# Altium schematic sheet 200512B_Schematic.SchDoc: 300W AMPLIFIER
size 520 x 788 mm; SheetNumber: 1; SheetTotal: 1
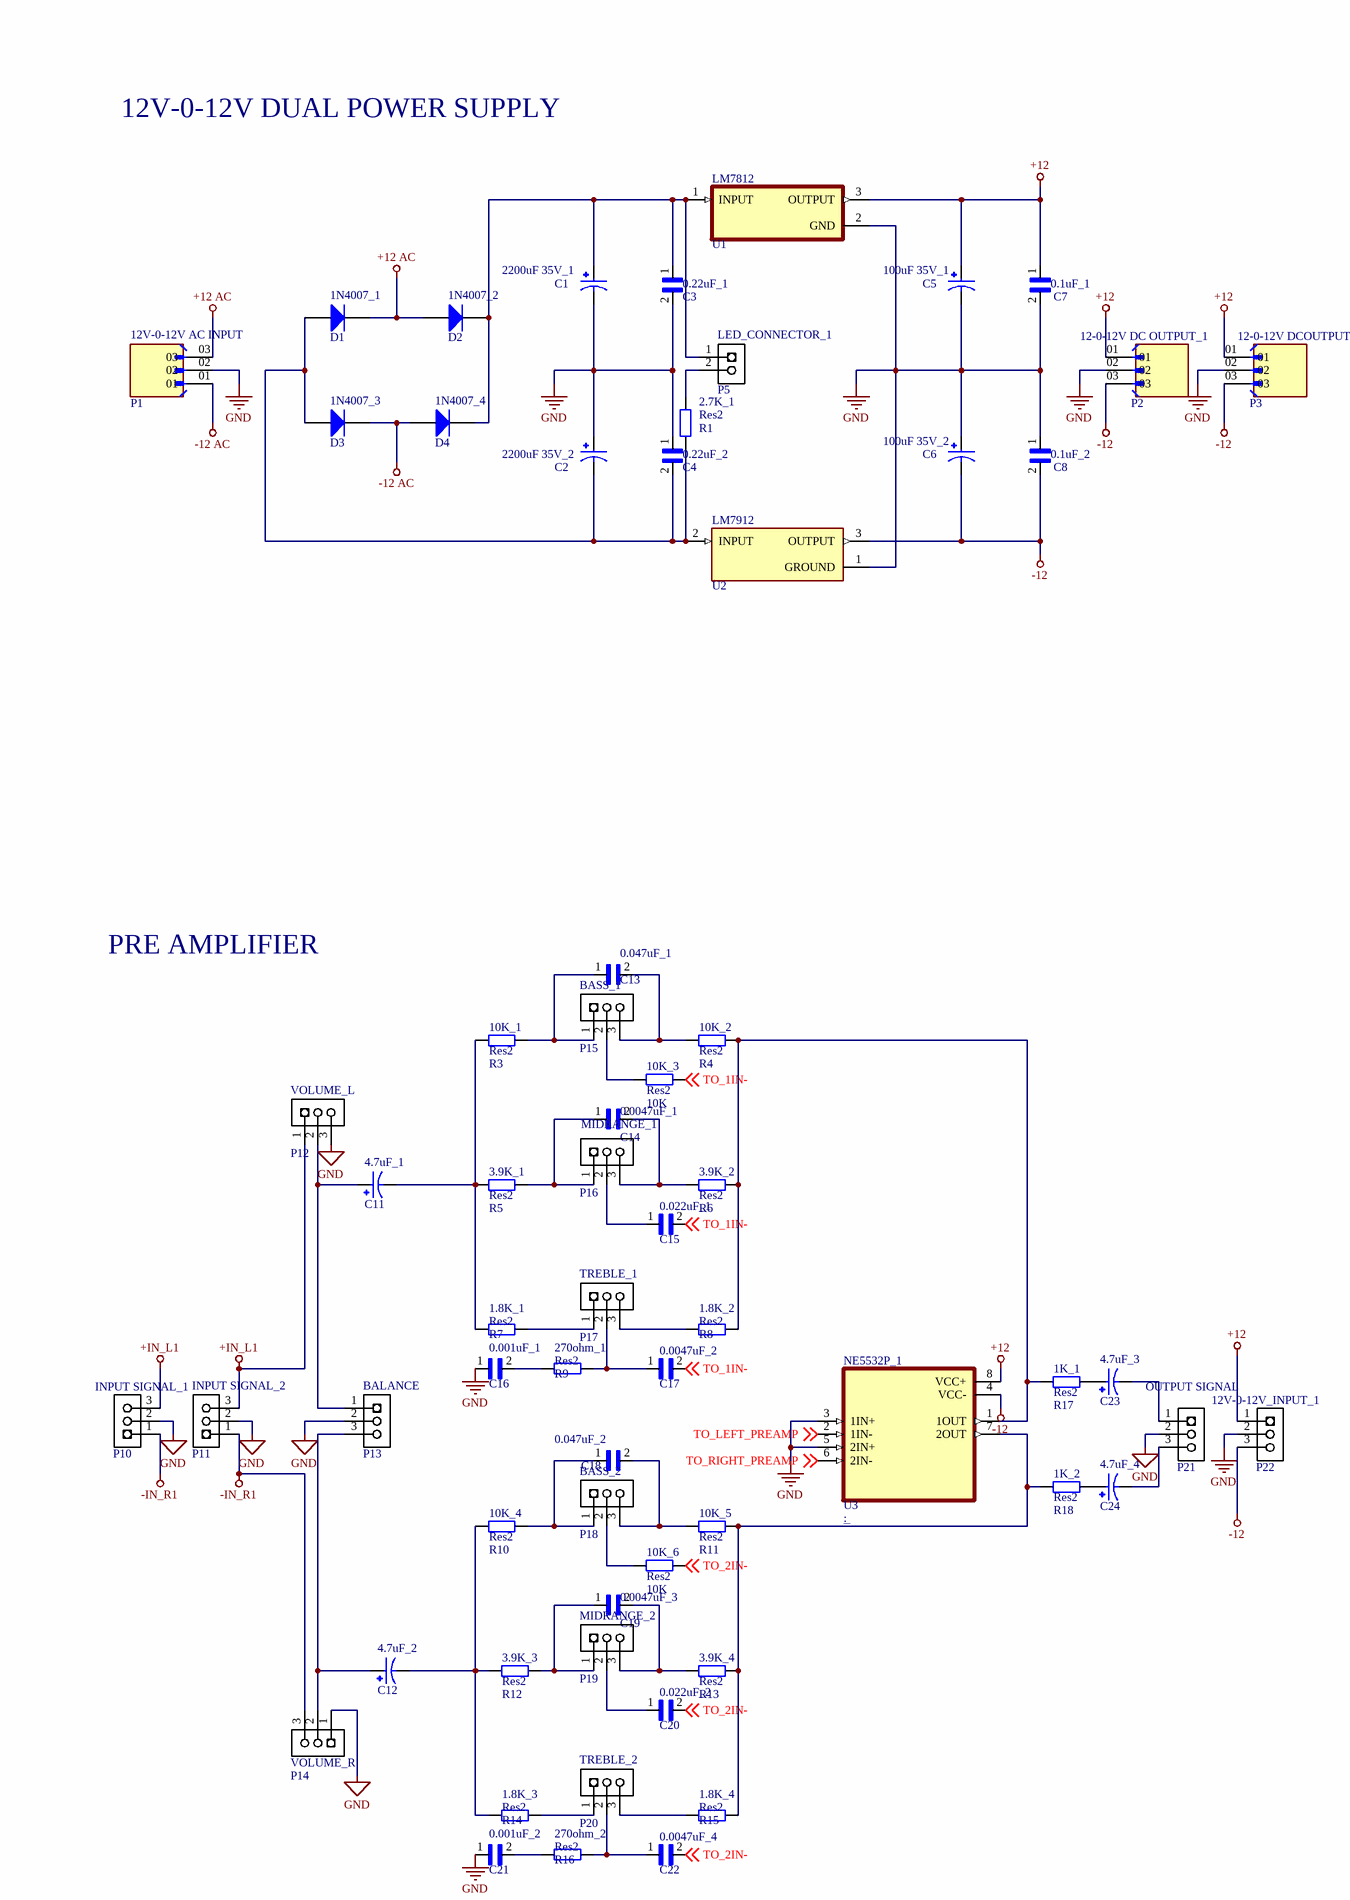
[diagram p0: 200512B_Schematic.SchDoc, top left]
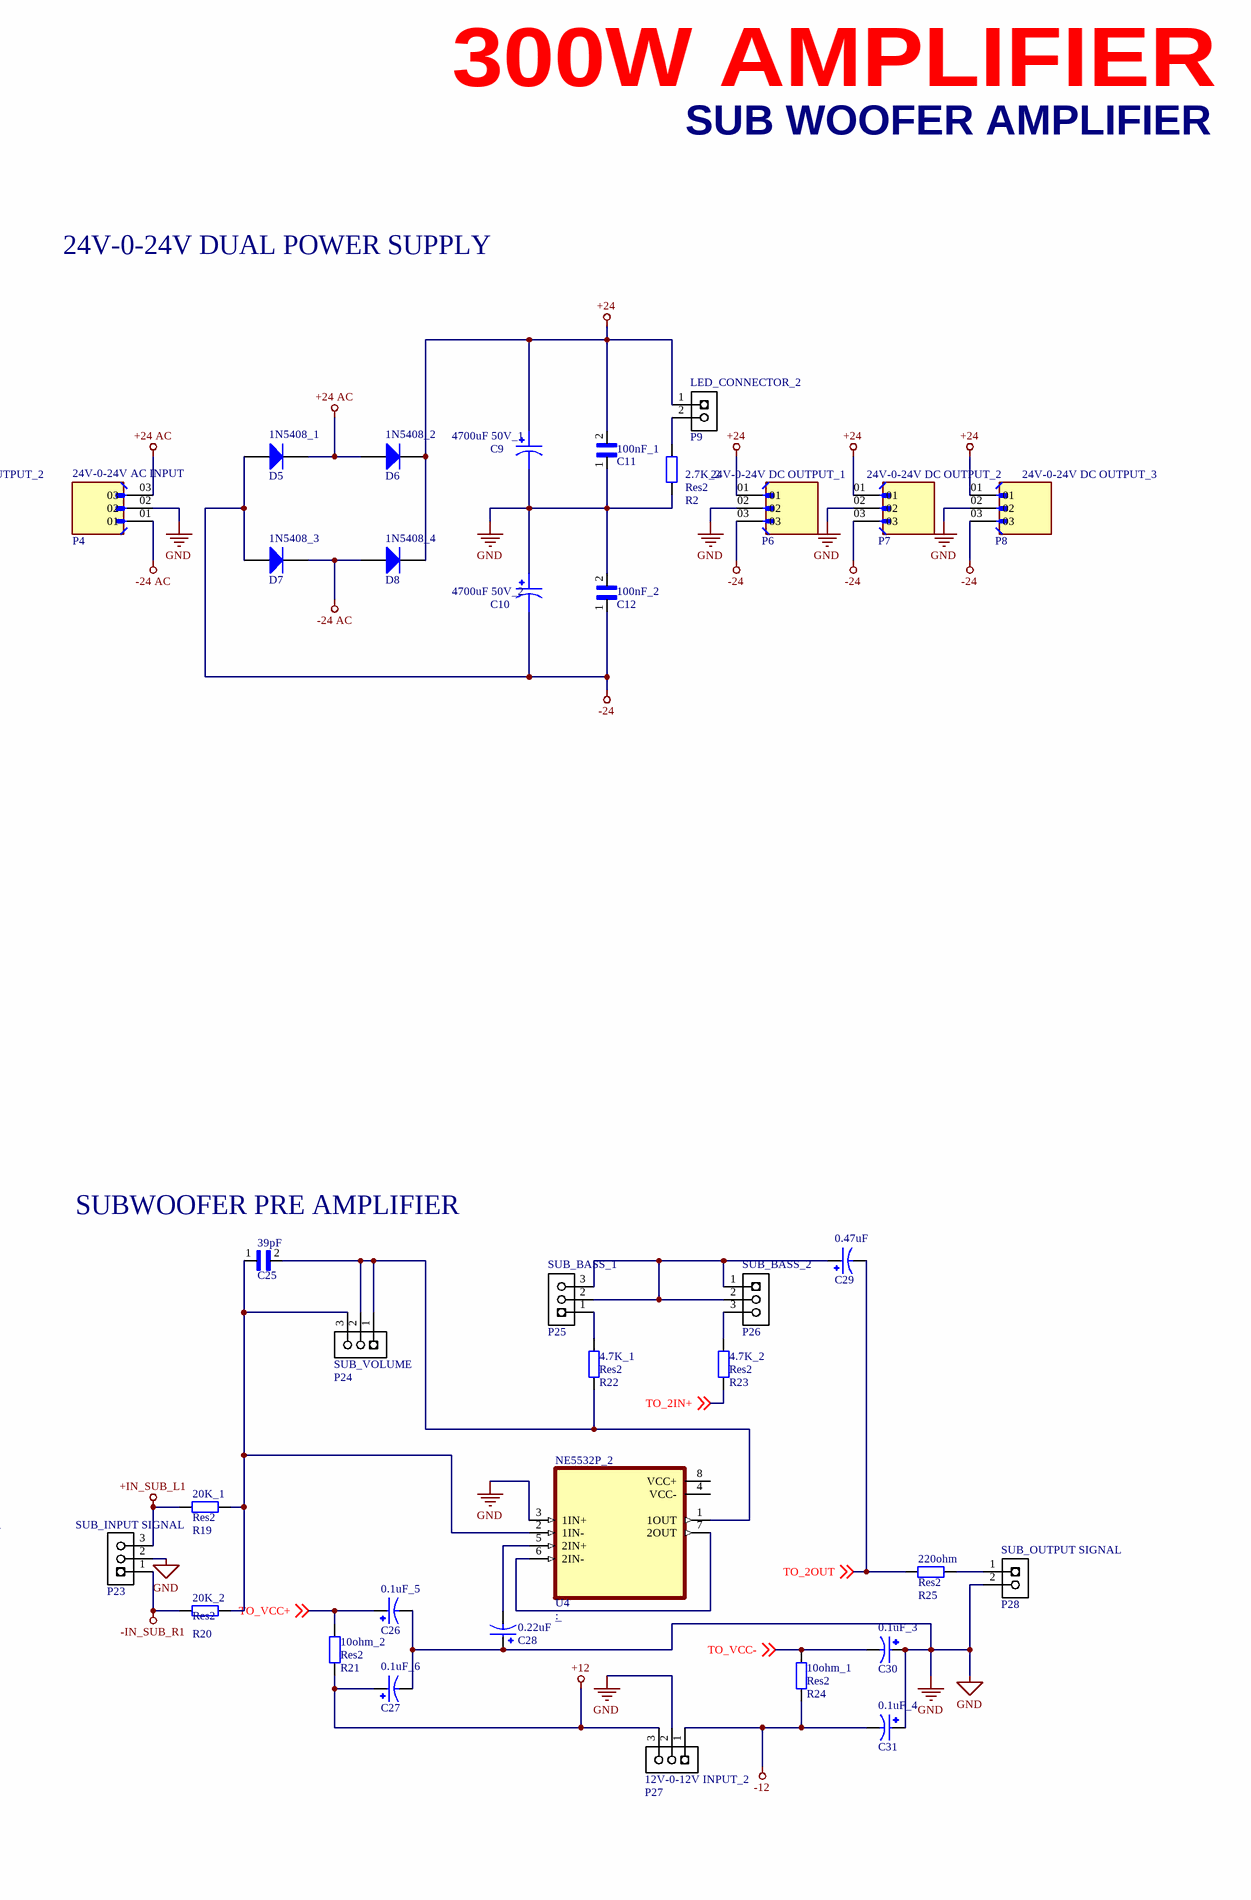
[diagram p1: 200512B_Schematic.SchDoc, top right]
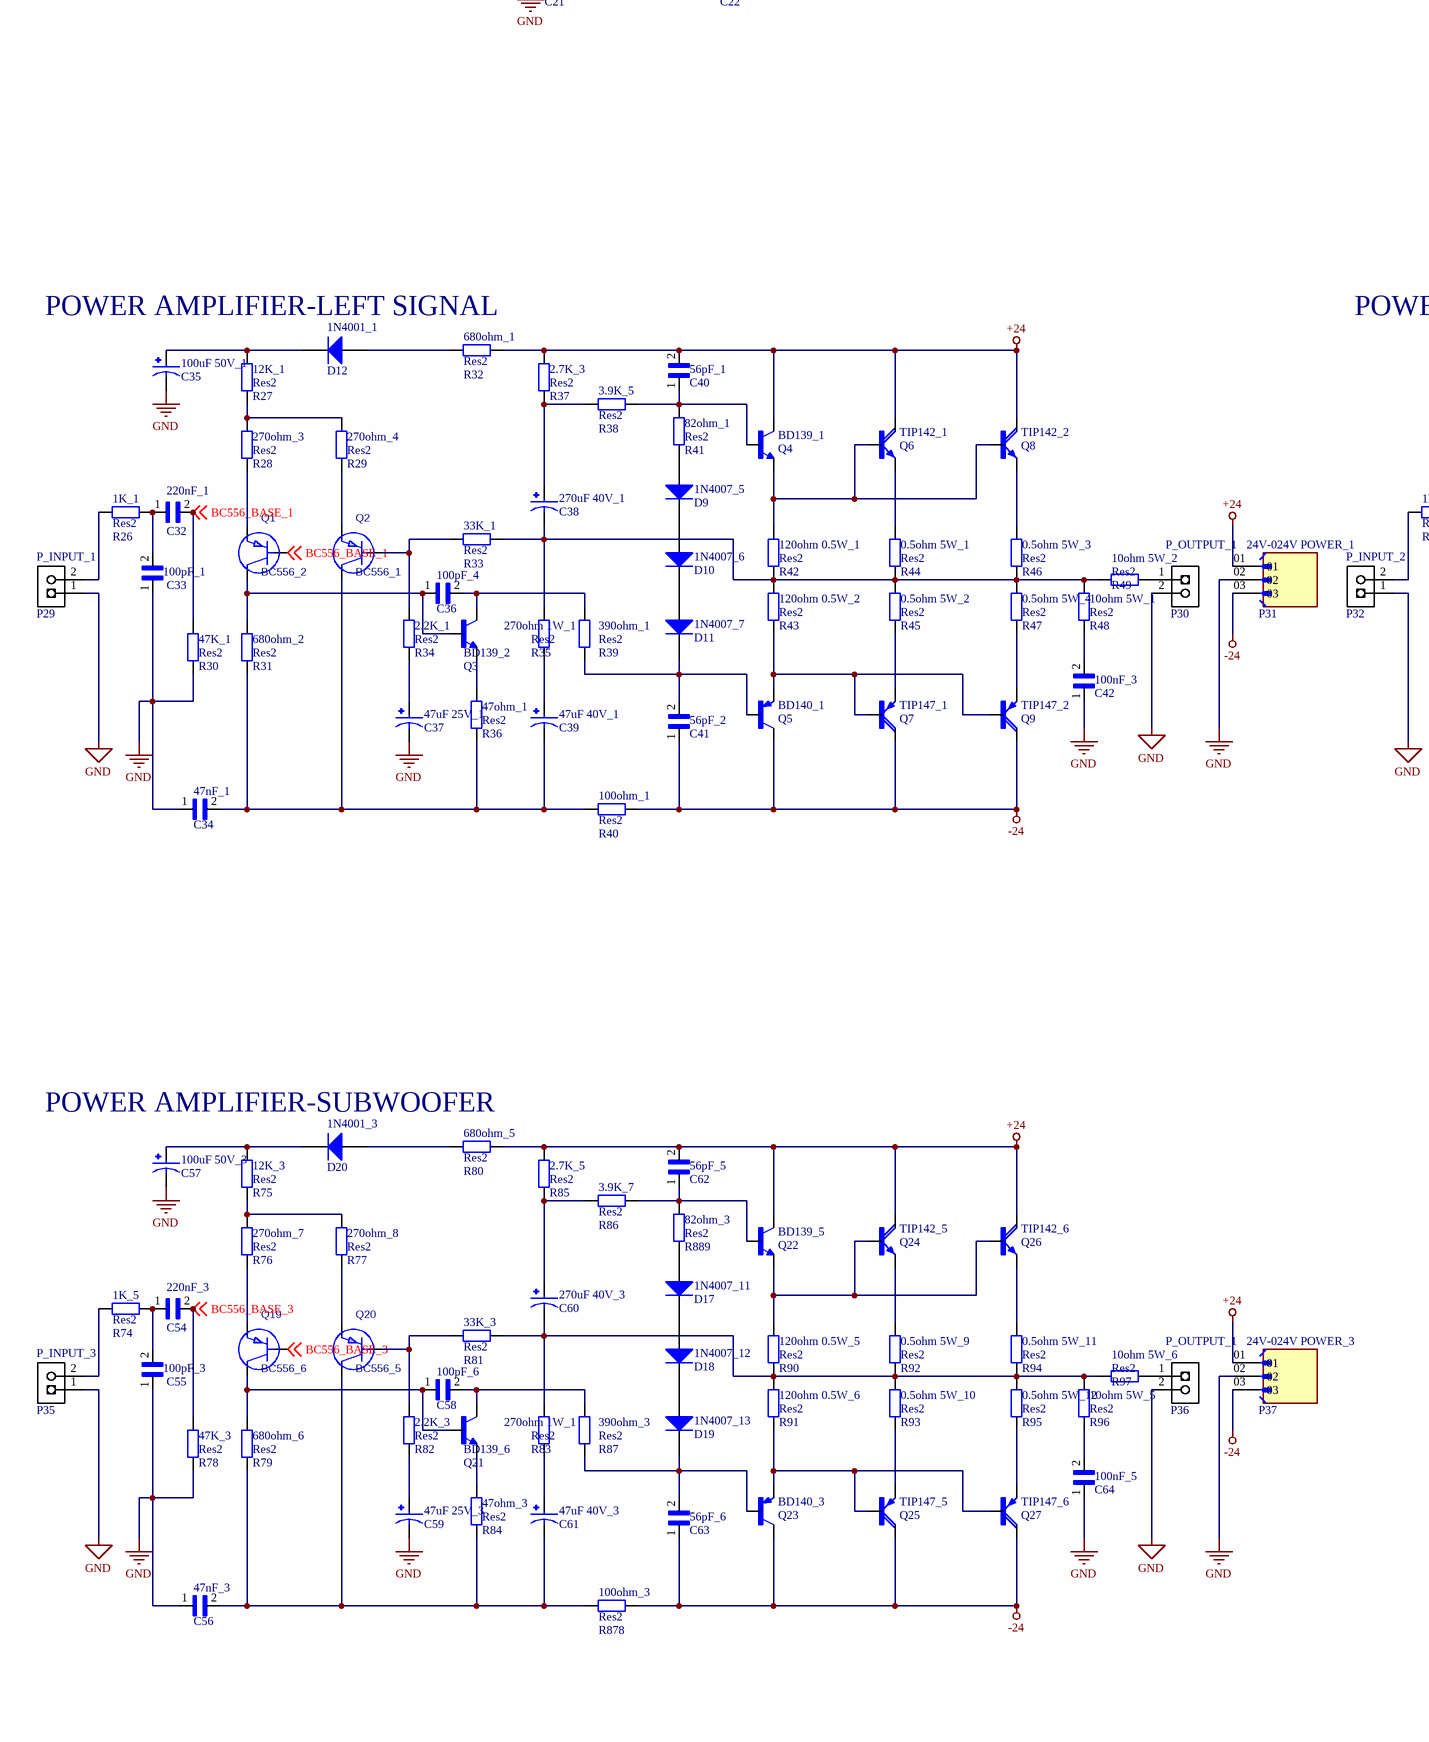
[diagram p2: 200512B_Schematic.SchDoc, bottom left]
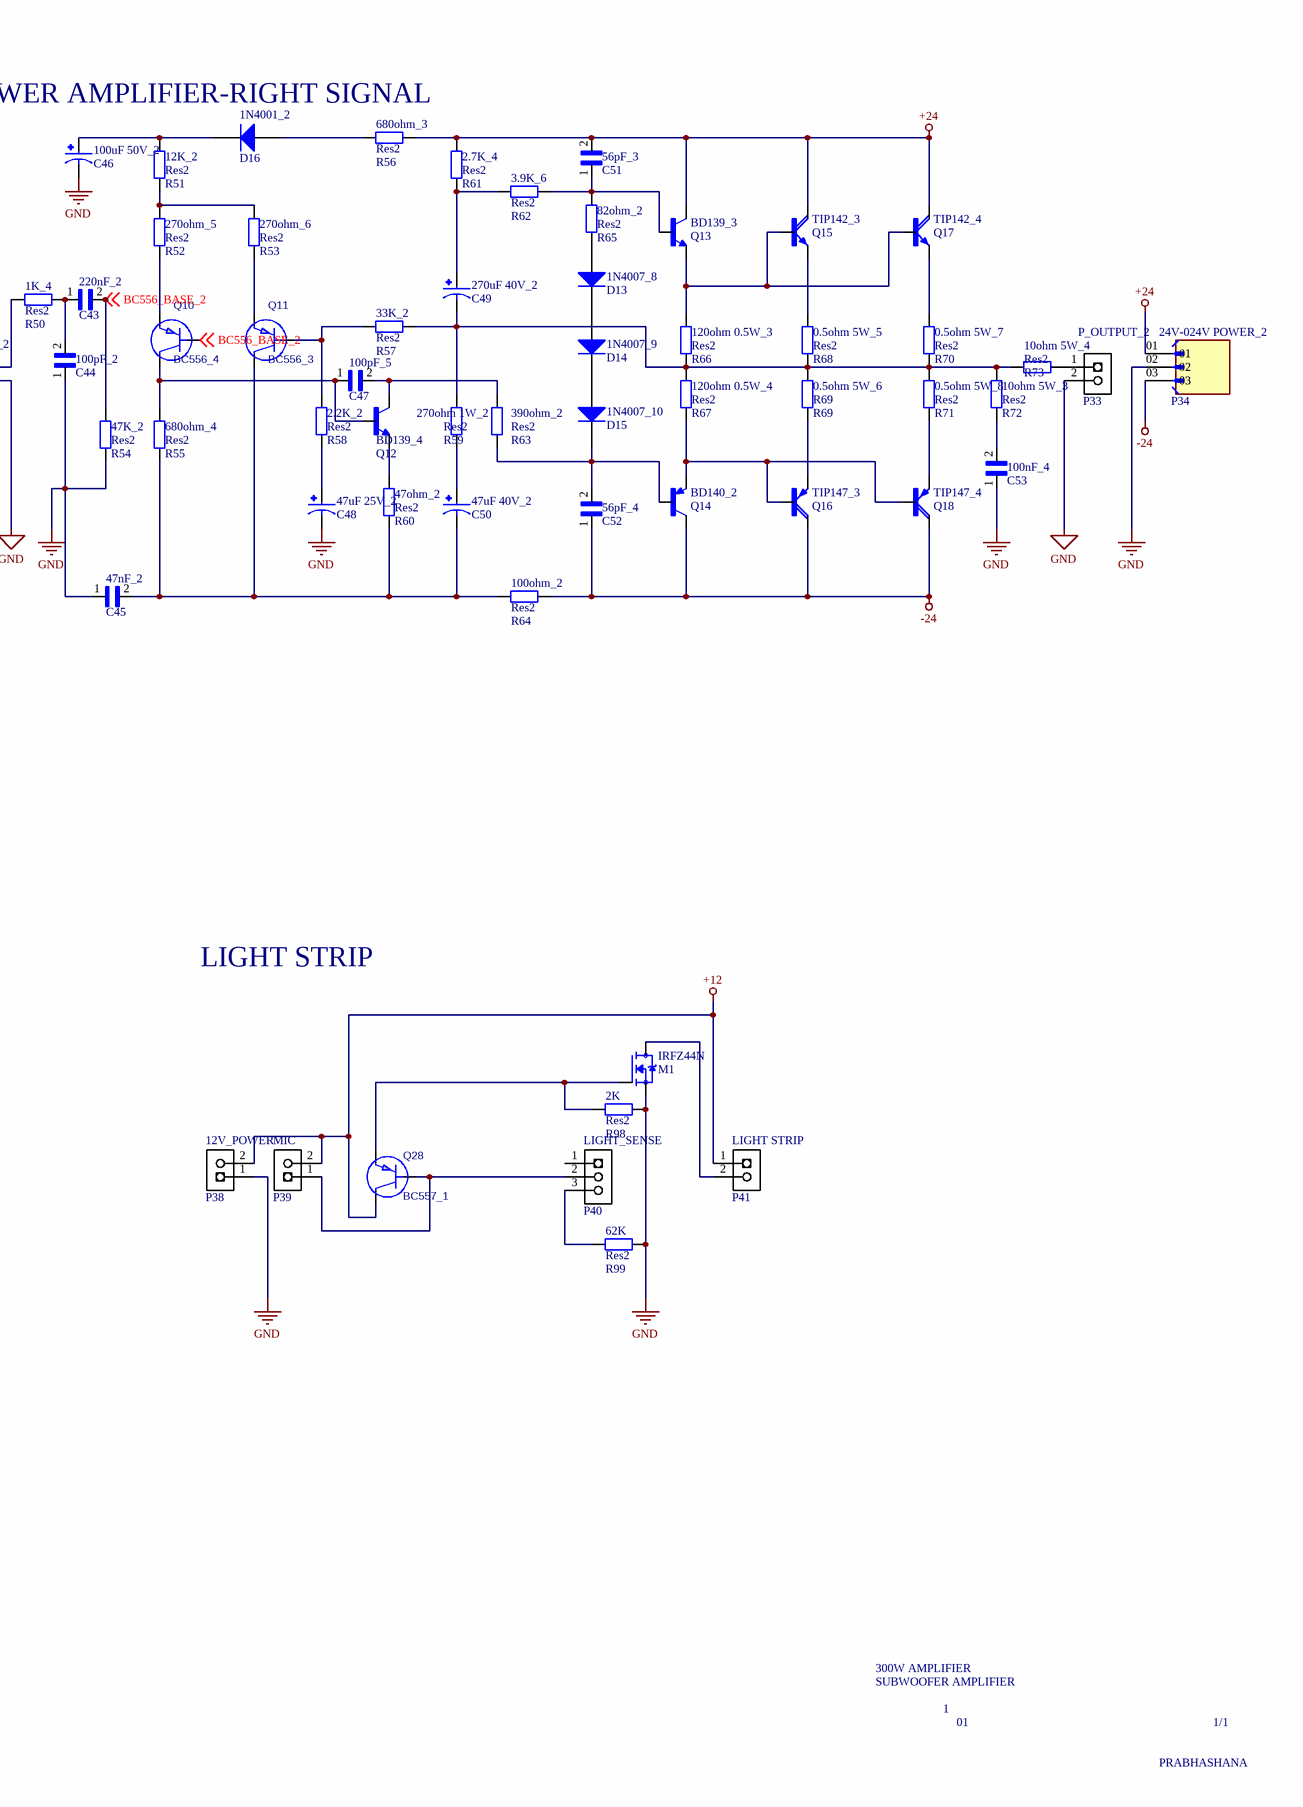
[diagram p3: 200512B_Schematic.SchDoc, bottom right]

## Parts
(Parts that share a designator on the sheet are numbered #1, #2 ... from top to bottom, then left to right.)
0.001uF_1  C16  [CAP_RDE5C1H273J2M1H03A]
0.1uF_1  C7  [CAP_RDE5C1H273J2M1H03A]
0.001uF_2  C21  [CAP_RDE5C1H273J2M1H03A]
0.1uF_2  C8  [CAP_RDE5C1H273J2M1H03A]
0.1uF_3  C30  [CAPPRD350W60D800H1150]
0.1uF_4  C31  [CAPPRD350W60D800H1150]
0.1uF_5  C26  [CAPPRD350W60D800H1150]
0.1uF_6  C27  [CAPPRD350W60D800H1150]
0.5ohm_5W_1  Res2  value R44  [AXIAL-0.4]
0.5ohm_5W_2  Res2  value R45  [AXIAL-0.4]
0.5ohm_5W_3  Res2  value R46  [AXIAL-0.4]
0.5ohm_5W_4  Res2  value R47  [AXIAL-0.4]
0.5ohm_5W_5  Res2  value R68  [AXIAL-0.4]
0.5ohm_5W_6  R69  [AXIAL-0.4]
0.5ohm_5W_7  Res2  value R70  [AXIAL-0.4]
0.5ohm_5W_8  Res2  value R71  [AXIAL-0.4]
0.5ohm_5W_9  Res2  value R92  [AXIAL-0.4]
0.5ohm_5W_10  Res2  value R93  [AXIAL-0.4]
0.5ohm_5W_11  Res2  value R94  [AXIAL-0.4]
0.5ohm_5W_12  Res2  value R95  [AXIAL-0.4]
0.22uF  C28  [CAPPRD350W60D800H1150]
0.022uF_1  C15  [CAP_RDE5C1H273J2M1H03A]
0.22uF_1  C3  [CAP_RDE5C1H273J2M1H03A]
0.022uF_2  C20  [CAP_RDE5C1H273J2M1H03A]
0.22uF_2  C4  [CAP_RDE5C1H273J2M1H03A]
0.47uF  C29  [CAPPRD350W60D800H1150]
0.047uF_1  C13  [CAP_RDE5C1H273J2M1H03A]
0.0047uF_1  C14  [CAP_RDE5C1H273J2M1H03A]
0.0047uF_2  C17  [CAP_RDE5C1H273J2M1H03A]
0.047uF_2  C18  [CAP_RDE5C1H273J2M1H03A]
0.0047uF_3  C19  [CAP_RDE5C1H273J2M1H03A]
0.0047uF_4  C22  [CAP_RDE5C1H273J2M1H03A]
1.8K_1  Res2  value R7  [AXIAL-0.4]
1.8K_2  Res2  value R8  [AXIAL-0.4]
1.8K_3  Res2  value R14  [AXIAL-0.4]
1.8K_4  Res2  value R15  [AXIAL-0.4]
1K_1#1  Res2  value R17  [AXIAL-0.4]
1K_1#2  Res2  value R26  [AXIAL-0.4]
1K_2  Res2  value R18  [AXIAL-0.4]
1K_4  Res2  value R50  [AXIAL-0.4]
1K_5  Res2  value R74  [AXIAL-0.4]
1N4001_1  D12  [DO-41]
1N4001_2  D16  [DO-41]
1N4001_3  D20  [DO-41]
1N4007_1  D1  [DO-41]
1N4007_2  D2  [DO-41]
1N4007_3  D3  [DO-41]
1N4007_4  D4  [DO-41]
1N4007_5  D9  [DO-41]
1N4007_6  D10  [DO-41]
1N4007_7  D11  [DO-41]
1N4007_8  D13  [DO-41]
1N4007_9  D14  [DO-41]
1N4007_10  D15  [DO-41]
1N4007_11  D17  [DO-41]
1N4007_12  D18  [DO-41]
1N4007_13  D19  [DO-41]
1N5408_1  D5  [DO-201AD]
1N5408_2  D6  [DO-201AD]
1N5408_3  D7  [DO-201AD]
1N5408_4  D8  [DO-201AD]
2.2K_1  Res2  value R34  [AXIAL-0.4]
2.2K_2  Res2  value R58  [AXIAL-0.4]
2.2K_3  Res2  value R82  [AXIAL-0.4]
2.7K_1  Res2  value R1  [AXIAL-0.4]
2.7K_2  Res2  value R2  [AXIAL-0.4]
2.7K_3  Res2  value R37  [AXIAL-0.4]
2.7K_4  Res2  value R61  [AXIAL-0.4]
2.7K_5  Res2  value R85  [AXIAL-0.4]
2K  Res2  value R98  [AXIAL-0.4]
3.9K_1  Res2  value R5  [AXIAL-0.4]
3.9K_2  Res2  value R6  [AXIAL-0.4]
3.9K_3  Res2  value R12  [AXIAL-0.4]
3.9K_4  Res2  value R13  [AXIAL-0.4]
3.9K_5  Res2  value R38  [AXIAL-0.4]
3.9K_6  Res2  value R62  [AXIAL-0.4]
3.9K_7  Res2  value R86  [AXIAL-0.4]
4.7K_1  Res2  value R22  [AXIAL-0.4]
4.7K_2  Res2  value R23  [AXIAL-0.4]
4.7uF_1  C11  [CAPPRD350W60D800H1150]
4.7uF_2  C12  [CAPPRD350W60D800H1150]
4.7uF_3  C23  [CAPPRD350W60D800H1150]
4.7uF_4  C24  [CAPPRD350W60D800H1150]
10K_1  Res2  value R3  [AXIAL-0.4]
10K_2  Res2  value R4  [AXIAL-0.4]
10K_3  Res2  value 10K  [AXIAL-0.4]
10K_4  Res2  value R10  [AXIAL-0.4]
10K_5  Res2  value R11  [AXIAL-0.4]
10K_6  Res2  value 10K  [AXIAL-0.4]
10ohm_1  Res2  value R24  [AXIAL-0.4]
10ohm_2  Res2  value R21  [AXIAL-0.4]
10ohm_5W_1  Res2  value R48  [AXIAL-0.4]
10ohm_5W_2  Res2  value R49  [AXIAL-0.4]
10ohm_5W_3  Res2  value R72  [AXIAL-0.4]
10ohm_5W_4  Res2  value R73  [AXIAL-0.4]
10ohm_5W_5  Res2  value R96  [AXIAL-0.4]
10ohm_5W_6  Res2  value R97  [AXIAL-0.4]
12-0-12V_DC_OUTPUT_1  P2  [CAMDEN_CTB5000/3]
12-0-12V_DCOUTPUT_2  P3  [CAMDEN_CTB5000/3]
12K_1  Res2  value R27  [AXIAL-0.4]
12K_2  Res2  value R51  [AXIAL-0.4]
12K_3  Res2  value R75  [AXIAL-0.4]
12V-0-12V_AC_INPUT  P1  [CAMDEN_CTB5000/3]
12V-0-12V_INPUT_1  P22  [HEADER-1X3]
12V-0-12V_INPUT_2  P27  [HEADER-1X3]
12V_POWER  P38  [HEADER-1X2]
20K_1  Res2  value R19  [AXIAL-0.4]
20K_2  Res2  value R20  [AXIAL-0.4]
24V-0-24V_AC_INPUT  P4  [CAMDEN_CTB5000/3]
24V-0-24V_DC_OUTPUT_1  P6  [CAMDEN_CTB5000/3]
24V-0-24V_DC_OUTPUT_2  P7  [CAMDEN_CTB5000/3]
24V-0-24V_DC_OUTPUT_3  P8  [CAMDEN_CTB5000/3]
24V-024V_POWER_1  P31  [CAMDEN_CTB5000/3]
24V-024V_POWER_2  P34  [CAMDEN_CTB5000/3]
24V-024V_POWER_3  P37  [CAMDEN_CTB5000/3]
33K_1  Res2  value R33  [AXIAL-0.4]
33K_2  Res2  value R57  [AXIAL-0.4]
33K_3  Res2  value R81  [AXIAL-0.4]
39pF  C25  [CAP_RDE5C1H273J2M1H03A]
47K_1  Res2  value R30  [AXIAL-0.4]
47K_2  Res2  value R54  [AXIAL-0.4]
47K_3  Res2  value R78  [AXIAL-0.4]
47nF_1  C34  [CAP_RDE5C1H273J2M1H03A]
47nF_2  C45  [CAP_RDE5C1H273J2M1H03A]
47nF_3  C56  [CAP_RDE5C1H273J2M1H03A]
47ohm_1  Res2  value R36  [AXIAL-0.4]
47ohm_2  Res2  value R60  [AXIAL-0.4]
47ohm_3  Res2  value R84  [AXIAL-0.4]
47uF_25V_1  C37  [CAPPRD350W60D800H1150]
47uF_25V_2  C48  [CAPPRD350W60D800H1150]
47uF_25V_3  C59  [CAPPRD350W60D800H1150]
47uF_40V_1  C39  [CAPPRD350W60D800H1150]
47uF_40V_2  C50  [CAPPRD350W60D800H1150]
47uF_40V_3  C61  [CAPPRD350W60D800H1150]
56pF_1  C40  [CAP_RDE5C1H273J2M1H03A]
56pF_2  C41  [CAP_RDE5C1H273J2M1H03A]
56pF_3  C51  [CAP_RDE5C1H273J2M1H03A]
56pF_4  C52  [CAP_RDE5C1H273J2M1H03A]
56pF_5  C62  [CAP_RDE5C1H273J2M1H03A]
56pF_6  C63  [CAP_RDE5C1H273J2M1H03A]
62K  Res2  value R99  [AXIAL-0.4]
82ohm_1  Res2  value R41  [AXIAL-0.4]
82ohm_2  Res2  value R65  [AXIAL-0.4]
82ohm_3  Res2  value R889  [AXIAL-0.4]
100nF_1  C11  [CAP_RDE5C1H273J2M1H03A]
100nF_2  C12  [CAP_RDE5C1H273J2M1H03A]
100nF_3  C42  [CAP_RDE5C1H273J2M1H03A]
100nF_4  C53  [CAP_RDE5C1H273J2M1H03A]
100nF_5  C64  [CAP_RDE5C1H273J2M1H03A]
100ohm_1  Res2  value R40  [AXIAL-0.4]
100ohm_2  Res2  value R64  [AXIAL-0.4]
100ohm_3  Res2  value R878  [AXIAL-0.4]
100pF_1  C33  [CAP_RDE5C1H273J2M1H03A]
100pF_2  C44  [CAP_RDE5C1H273J2M1H03A]
100pF_3  C55  [CAP_RDE5C1H273J2M1H03A]
100pF_4  C36  [CAP_RDE5C1H273J2M1H03A]
100pF_5  C47  [CAP_RDE5C1H273J2M1H03A]
100pF_6  C58  [CAP_RDE5C1H273J2M1H03A]
100uF_35V_1  C5  [CAPPRD350W60D800H1150]
100uF_35V_2  C6  [CAPPRD350W60D800H1150]
100uF_50V_1  C35  [CAPPRD350W60D800H1150]
100uF_50V_2  C46  [CAPPRD350W60D800H1150]
100uF_50V_3  C57  [CAPPRD350W60D800H1150]
120ohm_0.5W_1  Res2  value R42  [AXIAL-0.4]
120ohm_0.5W_2  Res2  value R43  [AXIAL-0.4]
120ohm_0.5W_3  Res2  value R66  [AXIAL-0.4]
120ohm_0.5W_4  Res2  value R67  [AXIAL-0.4]
120ohm_0.5W_5  Res2  value R90  [AXIAL-0.4]
120ohm_0.5W_6  Res2  value R91  [AXIAL-0.4]
220nF_1  C32  [CAP_RDE5C1H273J2M1H03A]
220nF_2  C43  [CAP_RDE5C1H273J2M1H03A]
220nF_3  C54  [CAP_RDE5C1H273J2M1H03A]
220ohm  Res2  value R25  [AXIAL-0.4]
270ohm_1  Res2  value R9  [AXIAL-0.4]
270ohm_1W_1#1  Res2  value R35  [AXIAL-0.4]
270ohm_1W_1#2  Res2  value R83  [AXIAL-0.4]
270ohm_1W_2  Res2  value R59  [AXIAL-0.4]
270ohm_2  Res2  value R16  [AXIAL-0.4]
270ohm_3  Res2  value R28  [AXIAL-0.4]
270ohm_4  Res2  value R29  [AXIAL-0.4]
270ohm_5  Res2  value R52  [AXIAL-0.4]
270ohm_6  Res2  value R53  [AXIAL-0.4]
270ohm_7  Res2  value R76  [AXIAL-0.4]
270ohm_8  Res2  value R77  [AXIAL-0.4]
270uF_40V_1  C38  [CAPPRD350W60D800H1150]
270uF_40V_2  C49  [CAPPRD350W60D800H1150]
270uF_40V_3  C60  [CAPPRD350W60D800H1150]
390ohm_1  Res2  value R39  [AXIAL-0.4]
390ohm_2  Res2  value R63  [AXIAL-0.4]
390ohm_3  Res2  value R87  [AXIAL-0.4]
680ohm_1  Res2  value R32  [AXIAL-0.4]
680ohm_2  Res2  value R31  [AXIAL-0.4]
680ohm_3  Res2  value R56  [AXIAL-0.4]
680ohm_4  Res2  value R55  [AXIAL-0.4]
680ohm_5  Res2  value R80  [AXIAL-0.4]
680ohm_6  Res2  value R79  [AXIAL-0.4]
2200uF_35V_1  C1  [CAPPRD750W80D1600H3150]
2200uF_35V_2  C2  [CAPPRD750W80D1600H3150]
4700uF_50V_1  C9  [CAP_B41252A6478M060]
4700uF_50V_2  C10  [CAP_B41252A6478M060]
BALANCE  P13  [HEADER-1X3]
BASS_1  P15  [HEADER-1X3]
BASS_2  P18  [HEADER-1X3]
BC556_1  Q2  [TO-92]
BC556_2  Q1  [TO-92]
BC556_3  Q11  [TO-92]
BC556_4  Q10  [TO-92]
BC556_5  Q20  [TO-92]
BC556_6  Q19  [TO-92]
BC557_1  Q28  [TO-92]
BD139_1  Q4  [TO126]
BD139_2  Q3  [TO126]
BD139_3  Q13  [TO126]
BD139_4  Q12  [TO126]
BD139_5  Q22  [TO126]
BD139_6  Q21  [TO126]
BD140_1  Q5  [TO245P780X300X1364-3]
BD140_2  Q14  [TO245P780X300X1364-3]
BD140_3  Q23  [TO245P780X300X1364-3]
INPUT_SIGNAL_1  P10  [HEADER-1X3]
INPUT_SIGNAL_2  P11  [HEADER-1X3]
IRFZ44N  M1  [TO254P1016X419X2286-3]
LED_CONNECTOR_1  P5  [HEADER-1X2]
LED_CONNECTOR_2  P9  [HEADER-1X2]
LIGHT_SENSE  P40  [HEADER-1X3]
LIGHT_STRIP  P41  [HEADER-1X2]
LM7812  U1  [TO254P1054X470X1955-3]
LM7912  U2  [TO254P1054X470X1955-3]
MIC  P39  [HEADER-1X2]
MIDRANGE_1  P16  [HEADER-1X3]
MIDRANGE_2  P19  [HEADER-1X3]
NE5532P_1  U3  [DIP794W45P254L959H508Q8]
NE5532P_2  U4  [DIP794W45P254L959H508Q8]
OUTPUT_SIGNAL  P21  [HEADER-1X3]
P_INPUT_1  P29  [HEADER-1X2]
P_INPUT_2  P32  [HEADER-1X2]
P_INPUT_3  P35  [HEADER-1X2]
P_OUTPUT_1#1  P30  [HEADER-1X2]
P_OUTPUT_1#2  P36  [HEADER-1X2]
P_OUTPUT_2  P33  [HEADER-1X2]
SUB_BASS_1  P25  [HEADER-1X3]
SUB_BASS_2  P26  [HEADER-1X3]
SUB_INPUT_SIGNAL  P23  [HEADER-1X3]
SUB_OUTPUT_SIGNAL  P28  [HEADER-1X2]
SUB_VOLUME  P24  [HEADER-1X3]
TIP142_1  Q6  [SOT93]
TIP142_2  Q8  [SOT93]
TIP142_3  Q15  [SOT93]
TIP142_4  Q17  [SOT93]
TIP142_5  Q24  [SOT93]
TIP142_6  Q26  [SOT93]
TIP147_1  Q7  [SOT93]
TIP147_2  Q9  [SOT93]
TIP147_3  Q16  [SOT93]
TIP147_4  Q18  [SOT93]
TIP147_5  Q25  [SOT93]
TIP147_6  Q27  [SOT93]
TREBLE_1  P17  [HEADER-1X3]
TREBLE_2  P20  [HEADER-1X3]
VOLUME_L  P12  [HEADER-1X3]
VOLUME_R  P14  [HEADER-1X3]

## Nets
+12: 0.1uF_1.1 0.1uF_6.P 10ohm_2.1 12-0-12V_DC_OUTPUT_1.01 12-0-12V_DCOUTPUT_2.01 12V-0-12V_INPUT_1.1 12V-0-12V_INPUT_2.3 12V_POWER.2 100uF_35V_1.P BC557_1.C LIGHT_STRIP.1 LM7812.3(OUTPUT) MIC.2 NE5532P_1.8(VCC+)
+12 AC: 1N4007_1.2(K) 1N4007_2.1(A) 12V-0-12V_AC_INPUT.03
+24: 1N5408_2.2(K) 1N5408_4.2(K) 2.7K_3.2 2.7K_4.2 2.7K_5.2 24V-0-24V_DC_OUTPUT_1.01 24V-0-24V_DC_OUTPUT_2.01 24V-0-24V_DC_OUTPUT_3.01 24V-024V_POWER_1.01 24V-024V_POWER_2.01 24V-024V_POWER_3.01 56pF_1.2 56pF_3.2 56pF_5.2 100nF_1.2 680ohm_1.2 680ohm_3.2 680ohm_5.2 4700uF_50V_1.1 BD139_1.2(C) BD139_3.2(C) BD139_5.2(C) LED_CONNECTOR_2.1 TIP142_1.C TIP142_2.C TIP142_3.C TIP142_4.C TIP142_5.C TIP142_6.C
+24 AC: 1N5408_1.2(K) 1N5408_2.1(A) 24V-0-24V_AC_INPUT.03
+IN_L1: INPUT_SIGNAL_1.3 INPUT_SIGNAL_2.3 VOLUME_L.1
+IN_SUB_L1: 20K_1.1 SUB_INPUT_SIGNAL.3
-12: 0.1uF_2.2 0.1uF_4.N 10ohm_1.1 12-0-12V_DC_OUTPUT_1.03 12-0-12V_DCOUTPUT_2.03 12V-0-12V_INPUT_1.3 12V-0-12V_INPUT_2.1 100uF_35V_2.N LM7912.3(OUTPUT) NE5532P_1.4(VCC-)
-12 AC: 1N4007_3.2(K) 1N4007_4.1(A) 12V-0-12V_AC_INPUT.01
-24: 1N5408_1.1(A) 1N5408_3.1(A) 24V-0-24V_DC_OUTPUT_1.03 24V-0-24V_DC_OUTPUT_2.03 24V-0-24V_DC_OUTPUT_3.03 24V-024V_POWER_1.03 24V-024V_POWER_2.03 24V-024V_POWER_3.03 56pF_2.1 56pF_4.1 56pF_6.1 100nF_2.1 100ohm_1.2 100ohm_2.2 100ohm_3.2 4700uF_50V_2.2 BD140_1.2(C) BD140_2.2(C) BD140_3.2(C) TIP147_1.C TIP147_2.C TIP147_3.C TIP147_4.C TIP147_5.C TIP147_6.C
-24 AC: 1N5408_3.2(K) 1N5408_4.1(A) 24V-0-24V_AC_INPUT.01
-IN_R1: INPUT_SIGNAL_1.1 INPUT_SIGNAL_2.1 VOLUME_R.3
-IN_SUB_R1: 20K_2.1 SUB_INPUT_SIGNAL.1
GND: 0.001uF_1.1 0.1uF_1.2 0.001uF_2.1 0.1uF_2.1 0.1uF_3.P 0.1uF_4.P 0.1uF_5.N 0.1uF_6.N 0.22uF.P 0.22uF_1.2 0.22uF_2.1 2.7K_2.1 2K.2 12-0-12V_DC_OUTPUT_1.02 12-0-12V_DCOUTPUT_2.02 12V-0-12V_AC_INPUT.02 12V-0-12V_INPUT_1.2 12V-0-12V_INPUT_2.2 12V_POWER.1 24V-0-24V_AC_INPUT.02 24V-0-24V_DC_OUTPUT_1.02 24V-0-24V_DC_OUTPUT_2.02 24V-0-24V_DC_OUTPUT_3.02 24V-024V_POWER_1.02 24V-024V_POWER_2.02 24V-024V_POWER_3.02 47K_1.1 47K_2.1 47K_3.1 47nF_1.1 47nF_2.1 47nF_3.1 47uF_25V_1.N 47uF_25V_2.N 47uF_25V_3.N 62K.2 100nF_1.1 100nF_2.2 100nF_3.1 100nF_4.1 100nF_5.1 100pF_1.1 100pF_2.1 100pF_3.1 100uF_35V_1.N 100uF_35V_2.P 100uF_50V_1.N 100uF_50V_2.N 100uF_50V_3.N 2200uF_35V_1.N 2200uF_35V_2.P 4700uF_50V_1.2 4700uF_50V_2.1 BALANCE.2 INPUT_SIGNAL_1.2 INPUT_SIGNAL_2.2 IRFZ44N.3(S) LM7812.2(GND) LM7912.1(GROUND) NE5532P_1.3(1IN+) NE5532P_1.5(2IN+) NE5532P_2.3(1IN+) OUTPUT_SIGNAL.2 P_INPUT_1.1 P_INPUT_2.1 P_INPUT_3.1 P_OUTPUT_1#1.2 P_OUTPUT_1#2.2 P_OUTPUT_2.2 SUB_INPUT_SIGNAL.2 SUB_OUTPUT_SIGNAL.2 VOLUME_L.3 VOLUME_R.1
BC556_BASE_1: 47K_1.2 220nF_1.2 BC556_2.B ; off-sheet BC556_BASE_1
BC556_BASE_2: 47K_2.2 220nF_2.2 BC556_4.B ; off-sheet BC556_BASE_2
BC556_BASE_3: 47K_3.2 220nF_3.2 BC556_6.B ; off-sheet BC556_BASE_3
TO_1IN-: 0.022uF_1.2 0.0047uF_2.2 10K_3.2 ; off-sheet TO_1IN-
TO_2IN+: 4.7K_2.1 ; off-sheet TO_2IN+
TO_2IN-: 0.022uF_2.2 0.0047uF_4.2 10K_6.2 ; off-sheet TO_2IN-
TO_2OUT: 0.47uF.N 220ohm.1 ; off-sheet TO_2OUT
TO_LEFT_PREAMP: NE5532P_1.2(1IN-) ; off-sheet TO_LEFT_PREAMP
TO_RIGHT_PREAMP: NE5532P_1.6(2IN-) ; off-sheet TO_RIGHT_PREAMP
TO_VCC+: 0.1uF_5.P 10ohm_2.2 ; off-sheet TO_VCC+
TO_VCC-: 0.1uF_3.N 10ohm_1.2 ; off-sheet TO_VCC-
Net0.001uF_1_2: 0.001uF_1.2 270ohm_1.1
Net0.001uF_2_2: 0.001uF_2.2 270ohm_2.1
Net0.5ohm_5W_1_1: 0.5ohm_5W_1.1 0.5ohm_5W_2.2 0.5ohm_5W_3.1 0.5ohm_5W_4.2 10ohm_5W_1.2 10ohm_5W_2.2 33K_1.2 120ohm_0.5W_1.1 120ohm_0.5W_2.2 270ohm_1W_1#1.2 270uF_40V_1.N
Net0.5ohm_5W_1_2: 0.5ohm_5W_1.2 TIP142_1.E
Net0.5ohm_5W_2_1: 0.5ohm_5W_2.1 TIP147_1.E
Net0.5ohm_5W_3_2: 0.5ohm_5W_3.2 TIP142_2.E
Net0.5ohm_5W_4_1: 0.5ohm_5W_4.1 TIP147_2.E
Net0.5ohm_5W_5_1: 0.5ohm_5W_5.1 0.5ohm_5W_6.2 0.5ohm_5W_7.1 0.5ohm_5W_8.2 10ohm_5W_3.2 10ohm_5W_4.2 33K_2.2 120ohm_0.5W_3.1 120ohm_0.5W_4.2 270ohm_1W_2.2 270uF_40V_2.N
Net0.5ohm_5W_5_2: 0.5ohm_5W_5.2 TIP142_3.E
Net0.5ohm_5W_6_1: 0.5ohm_5W_6.1 TIP147_3.E
Net0.5ohm_5W_7_2: 0.5ohm_5W_7.2 TIP142_4.E
Net0.5ohm_5W_8_1: 0.5ohm_5W_8.1 TIP147_4.E
Net0.5ohm_5W_9_1: 0.5ohm_5W_9.1 0.5ohm_5W_10.2 0.5ohm_5W_11.1 0.5ohm_5W_12.2 10ohm_5W_5.2 10ohm_5W_6.2 33K_3.2 120ohm_0.5W_5.1 120ohm_0.5W_6.2 270ohm_1W_1#2.2 270uF_40V_3.N
Net0.5ohm_5W_9_2: 0.5ohm_5W_9.2 TIP142_5.E
Net0.5ohm_5W_10_1: 0.5ohm_5W_10.1 TIP147_5.E
Net0.5ohm_5W_11_2: 0.5ohm_5W_11.2 TIP142_6.E
Net0.5ohm_5W_12_1: 0.5ohm_5W_12.1 TIP147_6.E
Net0.022uF_1_1: 0.022uF_1.1 MIDRANGE_1.2
Net0.22uF_1_1: 0.22uF_1.1 1N4007_2.2(K) 1N4007_4.2(K) 2200uF_35V_1.P LED_CONNECTOR_1.1 LM7812.1(INPUT)
Net0.022uF_2_1: 0.022uF_2.1 MIDRANGE_2.2
Net0.22uF_2_2: 0.22uF_2.2 1N4007_1.1(A) 1N4007_3.1(A) 2.7K_1.1 2200uF_35V_2.N LM7912.2(INPUT)
Net0.22uF_N: 0.22uF.N NE5532P_2.5(2IN+)
Net0.047uF_1_1: 0.047uF_1.1 10K_1.2 BASS_1.1
Net0.0047uF_1_1: 0.0047uF_1.1 3.9K_1.2 MIDRANGE_1.1
Net0.047uF_1_2: 0.047uF_1.2 10K_2.1 BASS_1.3
Net0.0047uF_1_2: 0.0047uF_1.2 3.9K_2.1 MIDRANGE_1.3
Net0.0047uF_2_1: 0.0047uF_2.1 270ohm_1.2 TREBLE_1.2
Net0.047uF_2_1: 0.047uF_2.1 10K_4.2 BASS_2.1
Net0.047uF_2_2: 0.047uF_2.2 10K_5.1 BASS_2.3
Net0.0047uF_3_1: 0.0047uF_3.1 3.9K_3.2 MIDRANGE_2.1
Net0.0047uF_3_2: 0.0047uF_3.2 3.9K_4.1 MIDRANGE_2.3
Net0.0047uF_4_1: 0.0047uF_4.1 270ohm_2.2 TREBLE_2.2
Net0.47uF_P: 0.47uF.P SUB_BASS_1.2 SUB_BASS_1.3 SUB_BASS_2.1 SUB_BASS_2.2
Net1.8K_1_1: 1.8K_1.1 3.9K_1.1 4.7uF_1.N 10K_1.1
Net1.8K_1_2: 1.8K_1.2 TREBLE_1.1
Net1.8K_2_1: 1.8K_2.1 TREBLE_1.3
Net1.8K_2_2: 1.8K_2.2 1K_1#1.1 3.9K_2.2 10K_2.2 NE5532P_1.1(1OUT)
Net1.8K_3_1: 1.8K_3.1 3.9K_3.1 4.7uF_2.N 10K_4.1
Net1.8K_3_2: 1.8K_3.2 TREBLE_2.1
Net1.8K_4_1: 1.8K_4.1 TREBLE_2.3
Net1.8K_4_2: 1.8K_4.2 1K_2.1 3.9K_4.2 10K_5.2 NE5532P_1.7(2OUT)
Net1K_1#1_2: 1K_1#1.2 4.7uF_3.P
Net1K_1#2_1: 1K_1#2.1 P_INPUT_1.2
Net1K_1#2_2: 1K_1#2.2 100pF_1.2 220nF_1.1
Net1K_2_2: 1K_2.2 4.7uF_4.P
Net1K_4_1: 1K_4.1 P_INPUT_2.2
Net1K_4_2: 1K_4.2 100pF_2.2 220nF_2.1
Net1K_5_1: 1K_5.1 P_INPUT_3.2
Net1K_5_2: 1K_5.2 100pF_3.2 220nF_3.1
Net1N4001_1_1: 1N4001_1.1(A) 680ohm_1.1
Net1N4001_1_2: 1N4001_1.2(K) 12K_1.2 100uF_50V_1.P
Net1N4001_2_1: 1N4001_2.1(A) 680ohm_3.1
Net1N4001_2_2: 1N4001_2.2(K) 12K_2.2 100uF_50V_2.P
Net1N4001_3_1: 1N4001_3.1(A) 680ohm_5.1
Net1N4001_3_2: 1N4001_3.2(K) 12K_3.2 100uF_50V_3.P
Net1N4007_5_1: 1N4007_5.1(A) 82ohm_1.1
Net1N4007_5_2: 1N4007_5.2(K) 1N4007_6.1(A)
Net1N4007_6_2: 1N4007_6.2(K) 1N4007_7.1(A)
Net1N4007_7_2: 1N4007_7.2(K) 56pF_2.2 390ohm_1.1 BD140_1.3(B)
Net1N4007_8_1: 1N4007_8.1(A) 82ohm_2.1
Net1N4007_8_2: 1N4007_8.2(K) 1N4007_9.1(A)
Net1N4007_9_2: 1N4007_9.2(K) 1N4007_10.1(A)
Net1N4007_10_2: 1N4007_10.2(K) 56pF_4.2 390ohm_2.1 BD140_2.3(B)
Net1N4007_11_1: 1N4007_11.1(A) 82ohm_3.1
Net1N4007_11_2: 1N4007_11.2(K) 1N4007_12.1(A)
Net1N4007_12_2: 1N4007_12.2(K) 1N4007_13.1(A)
Net1N4007_13_2: 1N4007_13.2(K) 56pF_6.2 390ohm_3.1 BD140_3.3(B)
Net2.2K_1_1: 2.2K_1.1 47uF_25V_1.P
Net2.2K_1_2: 2.2K_1.2 33K_1.1 BC556_1.B
Net2.2K_2_1: 2.2K_2.1 47uF_25V_2.P
Net2.2K_2_2: 2.2K_2.2 33K_2.1 BC556_3.B
Net2.2K_3_1: 2.2K_3.1 47uF_25V_3.P
Net2.2K_3_2: 2.2K_3.2 33K_3.1 BC556_5.B
Net2.7K_1_2: 2.7K_1.2 LED_CONNECTOR_1.2
Net2.7K_2_2: 2.7K_2.2 LED_CONNECTOR_2.2
Net2.7K_3_1: 2.7K_3.1 3.9K_5.1 270uF_40V_1.P
Net2.7K_4_1: 2.7K_4.1 3.9K_6.1 270uF_40V_2.P
Net2.7K_5_1: 2.7K_5.1 3.9K_7.1 270uF_40V_3.P
Net2K_1: 2K.1 BC557_1.E IRFZ44N.1(G)
Net3.9K_5_2: 3.9K_5.2 56pF_1.1 82ohm_1.2 BD139_1.3(B)
Net3.9K_6_2: 3.9K_6.2 56pF_3.1 82ohm_2.2 BD139_3.3(B)
Net3.9K_7_2: 3.9K_7.2 56pF_5.1 82ohm_3.2 BD139_5.3(B)
Net4.7K_1_1: 4.7K_1.1 39pF.2 NE5532P_2.1(1OUT) SUB_VOLUME.1 SUB_VOLUME.2
Net4.7K_1_2: 4.7K_1.2 SUB_BASS_1.1
Net4.7K_2_2: 4.7K_2.2 SUB_BASS_2.3
Net4.7uF_1_P: 4.7uF_1.P BALANCE.1 VOLUME_L.2
Net4.7uF_2_P: 4.7uF_2.P BALANCE.3 VOLUME_R.2
Net4.7uF_3_N: 4.7uF_3.N OUTPUT_SIGNAL.1
Net4.7uF_4_N: 4.7uF_4.N OUTPUT_SIGNAL.3
Net10K_3_1: 10K_3.1 BASS_1.2
Net10K_6_1: 10K_6.1 BASS_2.2
Net10ohm_5W_1_1: 10ohm_5W_1.1 100nF_3.2
Net10ohm_5W_2_1: 10ohm_5W_2.1 P_OUTPUT_1#1.1
Net10ohm_5W_3_1: 10ohm_5W_3.1 100nF_4.2
Net10ohm_5W_4_1: 10ohm_5W_4.1 P_OUTPUT_2.1
Net10ohm_5W_5_1: 10ohm_5W_5.1 100nF_5.2
Net10ohm_5W_6_1: 10ohm_5W_6.1 P_OUTPUT_1#2.1
Net12K_1_1: 12K_1.1 270ohm_3.2 270ohm_4.2
Net12K_2_1: 12K_2.1 270ohm_5.2 270ohm_6.2
Net12K_3_1: 12K_3.1 270ohm_7.2 270ohm_8.2
Net20K_1_2: 20K_1.2 20K_2.2 39pF.1 NE5532P_2.2(1IN-) SUB_VOLUME.3
Net47nF_1_2: 47nF_1.2 47ohm_1.1 47uF_40V_1.N 100ohm_1.1 680ohm_2.1 BC556_1.C
Net47nF_2_2: 47nF_2.2 47ohm_2.1 47uF_40V_2.N 100ohm_2.1 680ohm_4.1 BC556_3.C
Net47nF_3_2: 47nF_3.2 47ohm_3.1 47uF_40V_3.N 100ohm_3.1 680ohm_6.1 BC556_5.C
Net47ohm_1_2: 47ohm_1.2 BD139_2.1(E)
Net47ohm_2_2: 47ohm_2.2 BD139_4.1(E)
Net47ohm_3_2: 47ohm_3.2 BD139_6.1(E)
Net47uF_40V_1_P: 47uF_40V_1.P 270ohm_1W_1#1.1
Net47uF_40V_2_P: 47uF_40V_2.P 270ohm_1W_2.1
Net47uF_40V_3_P: 47uF_40V_3.P 270ohm_1W_1#2.1
Net62K_1: 62K.1 LIGHT_SENSE.3
Net100pF_4_1: 100pF_4.1 680ohm_2.2 BC556_2.C BD139_2.3(B)
Net100pF_4_2: 100pF_4.2 390ohm_1.2 BD139_2.2(C)
Net100pF_5_1: 100pF_5.1 680ohm_4.2 BC556_4.C BD139_4.3(B)
Net100pF_5_2: 100pF_5.2 390ohm_2.2 BD139_4.2(C)
Net100pF_6_1: 100pF_6.1 680ohm_6.2 BC556_6.C BD139_6.3(B)
Net100pF_6_2: 100pF_6.2 390ohm_3.2 BD139_6.2(C)
Net120ohm_0.5W_1_2: 120ohm_0.5W_1.2 BD139_1.1(E) TIP142_1.B TIP142_2.B
Net120ohm_0.5W_2_1: 120ohm_0.5W_2.1 BD140_1.1(E) TIP147_1.B TIP147_2.B
Net120ohm_0.5W_3_2: 120ohm_0.5W_3.2 BD139_3.1(E) TIP142_3.B TIP142_4.B
Net120ohm_0.5W_4_1: 120ohm_0.5W_4.1 BD140_2.1(E) TIP147_3.B TIP147_4.B
Net120ohm_0.5W_5_2: 120ohm_0.5W_5.2 BD139_5.1(E) TIP142_5.B TIP142_6.B
Net120ohm_0.5W_6_1: 120ohm_0.5W_6.1 BD140_3.1(E) TIP147_5.B TIP147_6.B
Net220ohm_2: 220ohm.2 SUB_OUTPUT_SIGNAL.1
Net270ohm_3_1: 270ohm_3.1 BC556_2.E
Net270ohm_4_1: 270ohm_4.1 BC556_1.E
Net270ohm_5_1: 270ohm_5.1 BC556_4.E
Net270ohm_6_1: 270ohm_6.1 BC556_3.E
Net270ohm_7_1: 270ohm_7.1 BC556_6.E
Net270ohm_8_1: 270ohm_8.1 BC556_5.E
NetBC557_1_B: BC557_1.B LIGHT_SENSE.2 MIC.1
NetIRFZ44N_2: IRFZ44N.2(D) LIGHT_STRIP.2
NetNE5532P_2_6: NE5532P_2.6(2IN-) NE5532P_2.7(2OUT)

Not connected (* = marked no-connect by the designer): LIGHT_SENSE 1; NE5532P_2 4(VCC-) 8(VCC+)

## Notes on the sheet
- 300W AMPLIFIER
- SUB WOOFER AMPLIFIER
- 12V-0-12V DUAL POWER SUPPLY
- 24V-0-24V DUAL POWER SUPPLY
- PRE AMPLIFIER
- (near 39pF) SUBWOOFER PRE AMPLIFIER
- POWER AMPLIFIER-LEFT SIGNAL
- POWER AMPLIFIER-RIGHT SIGNAL
- POWER AMPLIFIER-SUBWOOFER
- LIGHT STRIP
- SUBWOOFER AMPLIFIER
- 1
- 01
- 1/1
- PRABHASHANA

## Library data of the parts
0.001uF_1 0.1uF_1 0.001uF_2 0.1uF_2 0.022uF_1 0.22uF_1 0.022uF_2 0.22uF_2 0.047uF_1 0.0047uF_1 0.0047uF_2 0.047uF_2 0.0047uF_3 0.0047uF_4 39pF 47nF_1-47nF_3 56pF_1-56pF_6 100nF_1-100nF_5 100pF_1-100pF_6 220nF_1-220nF_3 = RDE5C1H273J2M1H03A: Lead Capacitor C0G_EIA_ with Capacitance: 27000pF and Rated Voltage: 50Vdc; MF: Murata; Price: None; Value: *; Package: NONSTANDARD; SnapEDA_Link: https://www.snapeda.com/parts/RDE5C1H273J2M1H03A/Murata/view-part/4544923/?ref=snap; Availability: Unavailable; MP: RDE5C1H273J2M1H03A
0.1uF_3-0.1uF_6 0.22uF 0.47uF 4.7uF_1-4.7uF_4 47uF_25V_1-47uF_25V_3 47uF_40V_1-47uF_40V_3 100uF_35V_1 100uF_35V_2 100uF_50V_1-100uF_50V_3 270uF_40V_1-270uF_40V_3 = ECA1HM101: 100ÂµF 50V Aluminum Electrolytic Capacitors Radial, Can 2000 Hrs @ 85Â°C; MF: Panasonic; Check_prices: https://www.snapeda.com/parts/ECA1HM101/Panasonic/view-part/4478734/?ref=eda; SnapEDA_Link: https://www.snapeda.com/parts/ECA1HM101/Panasonic/view-part/4478734/?ref=snap; Price: None; Availability: No availability data; Package: RADIAL-2 Panasonic; MP: ECA1HM101; Value: *
0.5ohm_5W_1-0.5ohm_5W_12 1.8K_1-1.8K_4 1K_1#1 1K_1#2 1K_2 1K_4 1K_5 2.2K_1-2.2K_3 2.7K_1-2.7K_5 2K 3.9K_1-3.9K_7 4.7K_1 4.7K_2 10K_1-10K_6 10ohm_1 10ohm_2 10ohm_5W_1-10ohm_5W_6 12K_1-12K_3 20K_1 20K_2 33K_1-33K_3 47K_1-47K_3 47ohm_1-47ohm_3 62K 82ohm_1-82ohm_3 100ohm_1-100ohm_3 120ohm_0.5W_1-120ohm_0.5W_6 220ohm 270ohm_1 270ohm_1W_1#1 270ohm_1W_1#2 270ohm_1W_2 270ohm_2-270ohm_8 390ohm_1-390ohm_3 680ohm_1-680ohm_6 = Res2: Resistor; Published: 8-Jun-2000; LatestRevisionDate: 17-Jul-2002; LatestRevisionNote: Re-released for DXP Platform.; PackageReference: AXIAL-0.4; Publisher: Altium Limited; PackageDescription: Axial Device, Thru-Hole; 2 Leads; 0.4 in Pin Spacing
  0.5ohm_5W_6: Value: R69
1N4001_1-1N4001_3 = Diode 1N4001: 1 Amp General Purpose Rectifier; Published: 8-Jun-2000; LatestRevisionDate: 17-Jul-2002; LatestRevisionNote: Re-released for DXP Platform.; DatasheetVersion: 1998; PackageVersion: Aug-1999; PackageReference: DO-41; Publisher: Altium Limited; PackageDescription: Diode, Axial; Body 5.2 x 2.7 mm (LxDia. max), Lead Dia. 0.86 mm (max); Code_JEDEC: DO-204-AL; ComponentLink1Description: Manufacturer Link; ComponentLink1URL: http://www.fairchildsemi.com/; ComponentLink2Description: Datasheet; ComponentLink2URL: http://www.fairchildsemi.com/ds/1N%2F1N4001.pdf
1N4007_1-1N4007_13 = Diode 1N4007: 1 Amp General Purpose Rectifier; Published: 8-Jun-2000; LatestRevisionDate: 17-Jul-2002; LatestRevisionNote: Re-released for DXP Platform.; DatasheetVersion: 1998; PackageVersion: Aug-1999; PackageReference: DO-41; Publisher: Altium Limited; PackageDescription: Diode, Axial; Body 5.2 x 2.7 mm (LxDia. max), Lead Dia. 0.86 mm (max); Code_JEDEC: DO-204-AL; ComponentLink1Description: Manufacturer Link; ComponentLink1URL: http://www.fairchildsemi.com/; ComponentLink2Description: Datasheet; ComponentLink2URL: http://www.fairchildsemi.com/ds/1N%2F1N4001.pdf
1N5408_1-1N5408_4 = Diode 1N5408: 3 Amp Medium Power Silicon Rectifier Diode; Published: 8-Jun-2000; LatestRevisionDate: 17-Jul-2002; LatestRevisionNote: Re-released for DXP Platform.; DatasheetVersion: Aug-1984; PackageReference: DO-201AD; Publisher: Altium Limited; PackageDescription: Diode, Axial; Body 9.5 x 5.3 mm (LxDia. max), Lead Dia. 1.32 mm (max); ComponentLink1Description: Manufacturer Link; ComponentLink1URL: http://www.irf.com/
12-0-12V_DC_OUTPUT_1 12-0-12V_DCOUTPUT_2 12V-0-12V_AC_INPUT 24V-0-24V_AC_INPUT 24V-0-24V_DC_OUTPUT_1-24V-0-24V_DC_OUTPUT_3 24V-024V_POWER_1-24V-024V_POWER_3 = CTB5000/3: Package: None; MP: CTB5000/3; Availability: Unavailable; Price: None; Value: *
12V-0-12V_INPUT_1 12V-0-12V_INPUT_2 BALANCE BASS_1 BASS_2 INPUT_SIGNAL_1 INPUT_SIGNAL_2 LIGHT_SENSE MIDRANGE_1 MIDRANGE_2 OUTPUT_SIGNAL SUB_BASS_1 SUB_BASS_2 SUB_INPUT_SIGNAL SUB_VOLUME TREBLE_1 TREBLE_2 VOLUME_L VOLUME_R = HEADER-1X3: Supplier 1: Digi-Key; Supplier Part Number 1: S1011E-36-ND
12V_POWER LED_CONNECTOR_1 LED_CONNECTOR_2 LIGHT_STRIP MIC P_INPUT_1-P_INPUT_3 P_OUTPUT_1#1 P_OUTPUT_1#2 P_OUTPUT_2 SUB_OUTPUT_SIGNAL = HEADER-1X2: REEL: TH; Supplier 1: Digi-Key; Supplier Part Number 1: S1011E-36-ND
2200uF_35V_1 2200uF_35V_2 = EEUFC1V222: 2200ÂµF 35V Aluminum Electrolytic Capacitors Radial, Can 5000 Hrs @ 105Â°C; MF: Panasonic; Check_prices: https://www.snapeda.com/parts/EEUFC1V222/Panasonic/view-part/5783312/?ref=eda; SnapEDA_Link: https://www.snapeda.com/parts/EEUFC1V222/Panasonic/view-part/5783312/?ref=snap; Availability: No availability data; MP: EEUFC1V222; Package: RADIAL-2 Panasonic; Price: None; Value: *
4700uF_50V_1 4700uF_50V_2 = B41252A6478M060: CAP ALUM 4700UF 20% 50V SNAP; MF: TDK; MP: B41252A6478M060; SnapEDA_Link: https://www.snapeda.com/parts/B41252A6478M060/TDK/view-part/?ref=snap; Availability: In Stock; Package: None; Purchase-URL: https://pricing.snapeda.com/search/part/B41252A6478M060/?ref=eda; Check_prices: https://www.snapeda.com/parts/B41252A6478M060/TDK/view-part/?ref=eda; Value: *; Price: None
BC556_1-BC556_6 = BC556: pin to pad: B>2 C>1 E>3; Value: {Value}
BC557_1 = BC557: pin to pad: B>2 C>1 E>3; Value: {Value}
BD139_1-BD139_6 = BD139: Bipolar (BJT) Transistor NPN 80 V 1.5 A - 1.25 W Through Hole TO-126-3; MF: ON Semiconductor; Value: *; SnapEDA_Link: https://www.snapeda.com/parts/BD139/Onsemi/view-part/?ref=snap; Purchase-URL: https://pricing.snapeda.com/search/part/BD139/?ref=eda; Availability: In Stock; Price: None; Package: TO-225-3 ON Semiconductor; Check_prices: https://www.snapeda.com/parts/BD139/Onsemi/view-part/?ref=eda; MP: BD139
BD140_1-BD140_3 = BD140: à¸—à¸£à¸²à¸™à¸‹à¸´à¸ªà¹€à¸•à¸­à¸£à¹Œà¸ªà¸­à¸‡à¸‚à¸±à¹‰à¸§ (BJT) PNP 80 V 1.5 A - 1.25 W à¸—à¸°à¸¥à¸¸à¸œà¹ˆà¸²à¸™à¸£à¸¹ TO-126-3; MF: ON; Value: *; SnapEDA_Link: https://www.snapeda.com/parts/BD140/Onsemi/view-part/?ref=snap; Purchase-URL: https://pricing.snapeda.com/search/part/BD140/?ref=eda; Availability: In Stock; Price: None; Package: TO-126 Multicomp; Check_prices: https://www.snapeda.com/parts/BD140/Onsemi/view-part/?ref=eda; MP: BD140
IRFZ44N = IRFZ44NPBF: N-Channel 55 V 49A (Tc) 94W (Tc) Through Hole TO-220AB; MF: Infineon; Purchase-URL: https://pricing.snapeda.com/search/part/IRFZ44NPBF/?ref=eda; SnapEDA_Link: https://www.snapeda.com/parts/IRFZ44NPBF/Infineon+Technologies/view-part/?ref=snap; Value: *; MP: IRFZ44NPBF; Package: TO-220-3 Infineon; Digi-Key_Part_Number: IRFZ44NPBF-ND; Check_prices: https://www.snapeda.com/parts/IRFZ44NPBF/Infineon+Technologies/view-part/?ref=eda
LM7812 = LM7812CT/NOPB: 1.5-A, 30-V, linear voltage regulator; MF: Texas Instruments; SnapEDA_Link: https://www.snapeda.com/parts/LM7812CT/NOPB/Texas+Instruments/view-part/?ref=snap; Availability: Unavailable; MP: LM7812CT/NOPB; Value: *; Check_prices: https://www.snapeda.com/parts/LM7812CT/NOPB/Texas+Instruments/view-part/?ref=eda; Package: TO-220-3; Price: None
LM7912 = LM7912CT/NOPB: 1.5-A, negative linear voltage regulator; MF: Texas Instruments; Availability: In Stock; SnapEDA_Link: https://www.snapeda.com/parts/LM7912CT/NOPB/Texas+Instruments/view-part/?ref=snap; Price: None; Check_prices: https://www.snapeda.com/parts/LM7912CT/NOPB/Texas+Instruments/view-part/?ref=eda; Package: TO-220-3 Texas Instruments; MP: LM7912CT/NOPB; Value: *; Purchase-URL: https://pricing.snapeda.com/search/part/LM7912CT/NOPB/?ref=eda
NE5532P_1 NE5532P_2 = NE5532P: Dual Low-Noise High-Speed Audio Operational Amplifier 8-PDIP 0 to 70; MF: Texas Instruments; Value: *; Price: None; Package: PDIP-8 Texas; SnapEDA_Link: https://www.snapeda.com/parts/NE5532P/Texas%20Instruments/view-part/9039/?ref=snap; Availability: Good; Purchase-URL: https://pricing.snapeda.com/search/part/NE5532P/?ref=eda; MP: NE5532P
TIP142_1-TIP142_6 = TIP142: Bipolar _BJT_ Transistor NPN - Darlington 100V 10A 125W Through Hole TO-247-3; MF: ON Semiconductor; Availability: Unavailable; MP: TIP142; Price: None; Value: *; SnapEDA_Link: https://www.snapeda.com/parts/TIP142/ON%20Semiconductor/view-part/2674398/?ref=snap; Package: TO-247 ON Semiconductor
TIP147_1-TIP147_6 = TIP147: Bipolar _BJT_ Transistor PNP 100V 10A 125W Through Hole TO-218; MF: ON Semiconductor; Availability: Unavailable; Value: *; Package: TO-247 ON Semiconductor; SnapEDA_Link: https://www.snapeda.com/parts/TIP147/ON%20Semiconductor/view-part/2712411/?ref=snap; Price: None; MP: TIP147